# EAGLE design o_clone_rev_b (EAGLE 9.2.2)
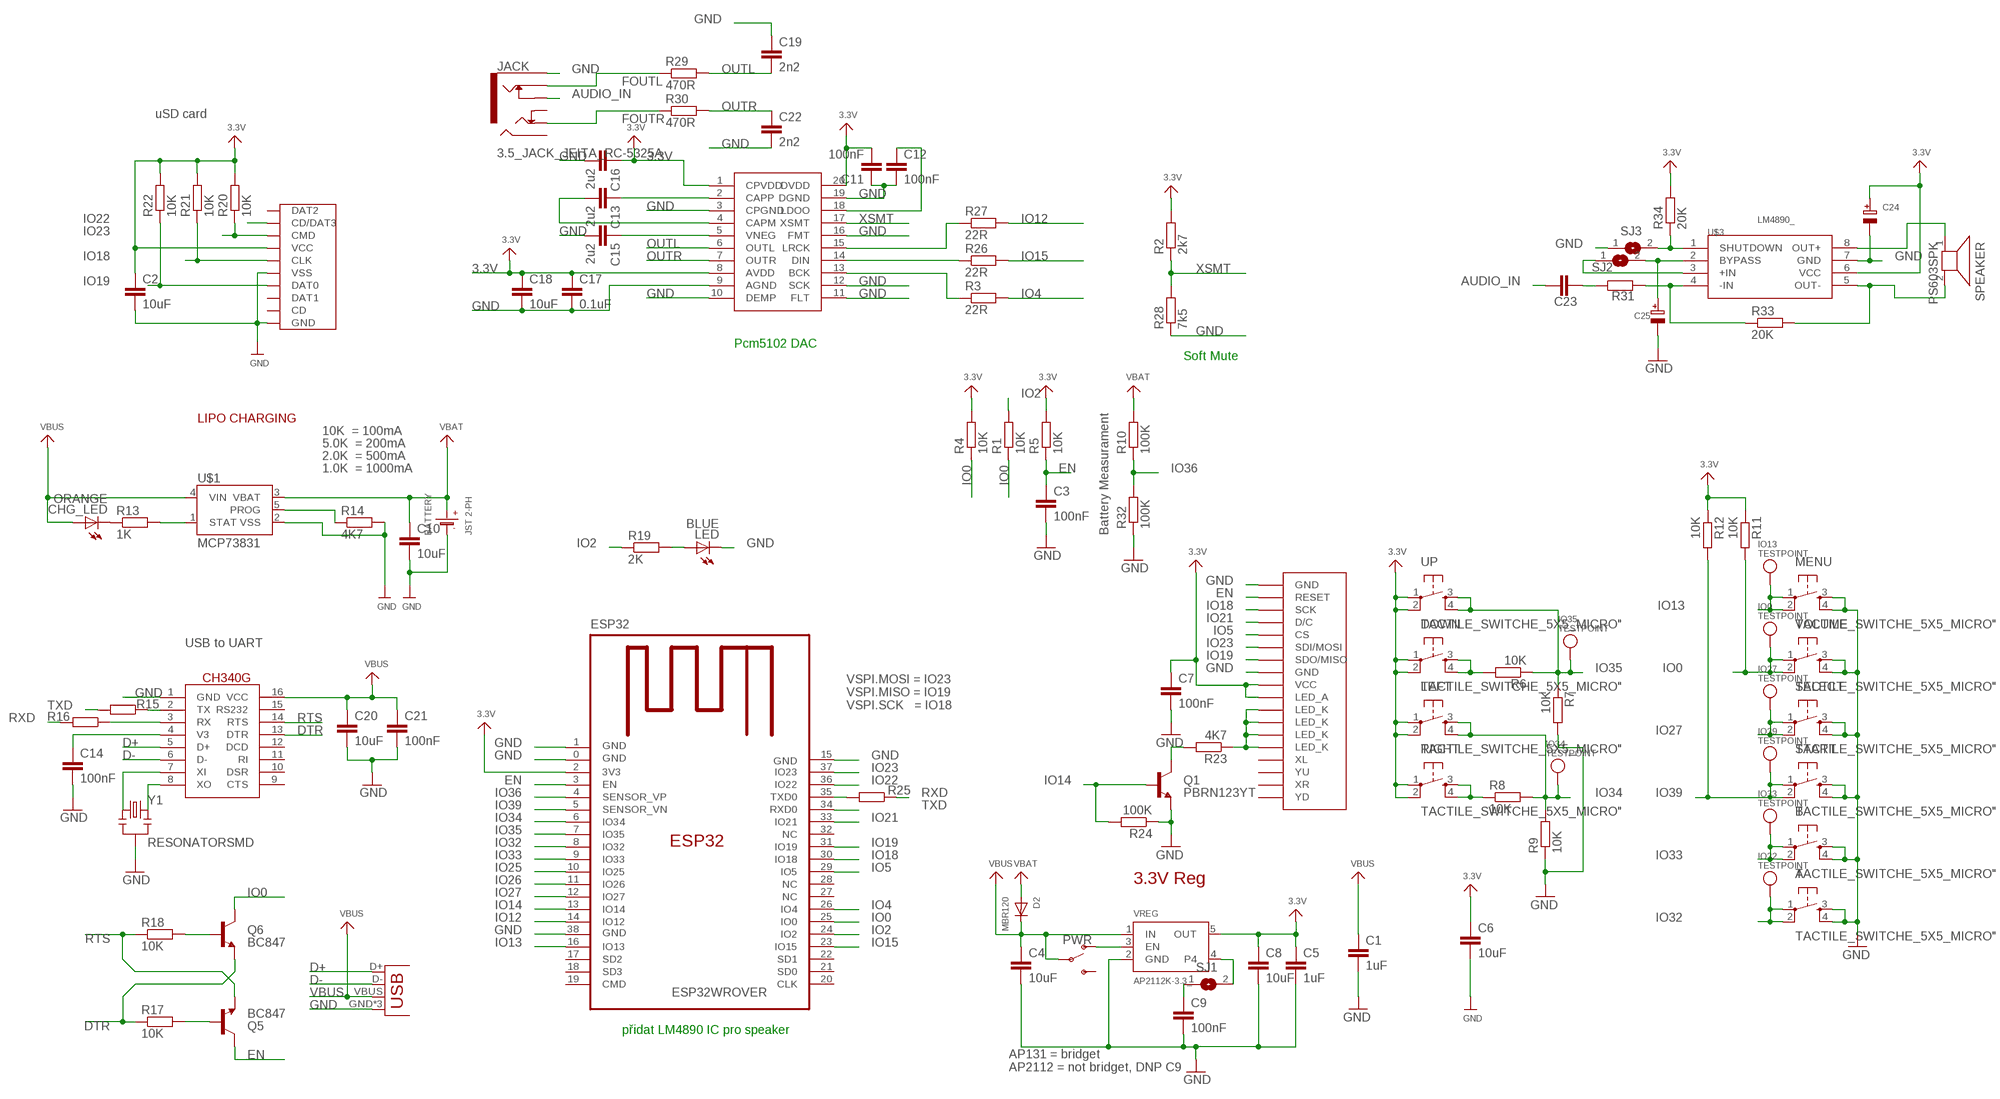
[diagram p0: schematic, sheet 1]

## Parts
A  TACTILE_SWITCHE_5X5_MICRO"  [TACTILE_SWITCH_5X5_MICRO]
B  TACTILE_SWITCHE_5X5_MICRO"  [TACTILE_SWITCH_5X5_MICRO]
BATTERY  JST 2-PH  JST_CONNECTOR  [JSTPH2]
C1  1uF  C-EUC0805  [C0805]
C2  10uF  C-EUC0805  [C0805]
C3  100nF  C-EUC0805  [C0805]
C4  10uF  C-EUC0805  [C0805]
C5  1uF  C-EUC0805  [C0805]
C6  10uF  C-EUC0805  [C0805]
C7  100nF  C-EUC0805  [C0805]
C8  10uF  C-EUC0805  [C0805]
C9  100nF  C-EUC0805  [C0805]
C10  10uF  C-EUC0805  [C0805]
C11  100nF  C-EUC0805  [C0805]
C12  100nF  C-EUC0805  [C0805]
C13  2u2  C-EUC0805  [C0805]
C14  100nF  C-EUC0805  [C0805]
C15  2u2  C-EUC0805  [C0805]
C16  2u2  C-EUC0805  [C0805]
C17  0.1uF  C-EUC0805  [C0805]
C18  10uF  C-EUC0805  [C0805]
C19  2n2  C-EUC0805  [C0805]
C20  10uF  C-EUC0805  [C0805]
C21  100nF  C-EUC0805  [C0805]
C22  2n2  C-EUC0805  [C0805]
C23  0.39uF (Fa:2896582)  C-EUC0805  [C0805]
C24  1uF (Fa:2491436)  CAP_TANTALUM_  [EIA2012]
C25  1uF (Fa:2491436)  CAP_TANTALUM_  [EIA2012]
CHG_LED  ORANGE  LEDCHIPLED_0805  [CHIPLED_0805]
D2  MBR120  DIODESOD-123  [SOD-123]
DOWN  TACTILE_SWITCHE_5X5_MICRO"  [TACTILE_SWITCH_5X5_MICRO]
ESP32  ESP32WROVER  [ESP32WROVER]
IO0  TESTPOINT  [TESTPOINT]
IO13  TESTPOINT  [TESTPOINT]
IO27  TESTPOINT  [TESTPOINT]
IO32  TESTPOINT  [TESTPOINT]
IO33  TESTPOINT  [TESTPOINT]
IO34  TESTPOINT  [TESTPOINT]
IO35  TESTPOINT  [TESTPOINT]
IO39  TESTPOINT  [TESTPOINT]
JACK  3.5_JACK_JEITA_RC-5325A  [3.5_JACK_JEITA_RC-5325A]
LCD  ILI9341_3.2LCD_  [LI9341_3.2LCD]
LED  BLUE  LEDCHIPLED_0805  [CHIPLED_0805]
LEFT  TACTILE_SWITCHE_5X5_MICRO"  [TACTILE_SWITCH_5X5_MICRO]
MENU  TACTILE_SWITCHE_5X5_MICRO"  [TACTILE_SWITCH_5X5_MICRO]
PCM5102  PCM5102  [TSSOP20]
PWR  SWITCH-SPDT-SMD-RIGHT-ANGLE  [SWITCH_SPST_SMD_A]
Q1  PBRN123YT  TRANSISTOR_NPNSOT23-3  [SOT23-3]
Q5  BC847  TRANSISTOR_NPNSOT23-3  [SOT23-3]
Q6  BC847  TRANSISTOR_NPNSOT23-3  [SOT23-3]
R1  10K  R-EU_R0805  [R0805]
R2  2k7  R-EU_R0805  [R0805]
R3  22R  R-EU_R0805  [R0805]
R4  10K  R-EU_R0805  [R0805]
R5  10K  R-EU_R0805  [R0805]
R6  10K  R-EU_R0805  [R0805]
R7  10K  R-EU_R0805  [R0805]
R8  10K  R-EU_R0805  [R0805]
R9  10K  R-EU_R0805  [R0805]
R10  100K  R-EU_R0805  [R0805]
R11  10K  R-EU_R0805  [R0805]
R12  10K  R-EU_R0805  [R0805]
R13  1K  R-EU_R0805  [R0805]
R14  4K7  R-EU_R0805  [R0805]
R15  470R  R-EU_R0805  [R0805]
R16  470R  R-EU_R0805  [R0805]
R17  10K  R-EU_R0805  [R0805]
R18  10K  R-EU_R0805  [R0805]
R19  2K  R-EU_R0805  [R0805]
R20  10K  R-EU_R0805  [R0805]
R21  10K  R-EU_R0805  [R0805]
R22  10K  R-EU_R0805  [R0805]
R23  4K7  R-EU_R0805  [R0805]
R24  100K  R-EU_R0805  [R0805]
R25  470R  R-EU_R0805  [R0805]
R26  22R  R-EU_R0805  [R0805]
R27  22R  R-EU_R0805  [R0805]
R28  7k5  R-EU_R0805  [R0805]
R29  470R  R-EU_R0805  [R0805]
R30  470R  R-EU_R0805  [R0805]
R31  20K  R-EU_R0805  [R0805]
R32  100K  R-EU_R0805  [R0805]
R33  20K  R-EU_R0805  [R0805]
R34  20K  R-EU_R0805  [R0805]
RIGHT  TACTILE_SWITCHE_5X5_MICRO"  [TACTILE_SWITCH_5X5_MICRO]
SD_CARD  MICRO_SD_CARD"  [TFP09-2--12B]
SELECT  TACTILE_SWITCHE_5X5_MICRO"  [TACTILE_SWITCH_5X5_MICRO]
SJ1  SJ  [SJ]
SJ2  SJ  [SJ]
SJ3  SJ  [SJ]
SPEAKER  PS603SPK  [PS603]
START  TACTILE_SWITCHE_5X5_MICRO"  [TACTILE_SWITCH_5X5_MICRO]
U$1  MCP73831  [SOT95P290X120-5]
U$3  LM4890_  [SOIC127P600X175-8]
U$23  CH340G  [SO16]
UP  TACTILE_SWITCHE_5X5_MICRO"  [TACTILE_SWITCH_5X5_MICRO]
USB  USB_MICRO_ATTEND_  [USB_MICRO]
VOLUME  TACTILE_SWITCHE_5X5_MICRO"  [TACTILE_SWITCH_5X5_MICRO]
VREG  AP2112K-3.3_  [SOT95P290X120-5]
Y1  RESONATORSMD  [RESONATOR-SMD]

## Nets
3.3V: C2.1 C5.1 C6.1 C7.1 C8.1 C11.2 C16.1 C17.1 C18.1 C24.+ DOWN.1 DOWN.2 ESP32.2(3V3) LCD.P$9(VCC) LCD.P$10(LED_A) LEFT.1 LEFT.2 PCM5102.1(CPVDD) PCM5102.8(AVDD) PCM5102.20(DVDD) R2.2 R4.2 R5.2 R11.1 R12.1 R20.2 R21.2 R22.2 R34.2 RIGHT.1 RIGHT.2 SD_CARD.VCC U$3.6(VCC) UP.1 UP.2 VREG.5(OUT)
AUDIO_IN: C23.1 JACK.6
D+: U$23.5(D+) USB.D+
D-: U$23.6(D-) USB.D-
DTR: Q6.2(E) R17.1 U$23.13(DTR)
EN: C3.1 ESP32.3(EN) LCD.P$2(RESET) Q5.3(C) R5.1
FOUTL: JACK.5 R29.1
FOUTR: JACK.3 R30.1
GND: A.3 A.4 B.3 B.4 BATTERY.1(-) C1.2 C2.2 C3.2 C4.2 C5.2 C6.2 C7.2 C8.2 C9.2 C10.2 C11.1 C12.2 C14.2 C15.2 C16.2 C17.2 C18.2 C19.1 C20.2 C21.2 C22.2 C24.- C25.- ESP32.0(GND) ESP32.1(GND) ESP32.15(GND) ESP32.38(GND) JACK.1 LCD.P$1(GND) LCD.P$8(GND) LED.C MENU.3 MENU.4 PCM5102.3(CPGND) PCM5102.9(AGND) PCM5102.10(DEMP) PCM5102.11(FLT) PCM5102.12(SCK) PCM5102.16(FMT) PCM5102.19(DGND) Q1.2(E) R7.2 R9.1 R14.2 R24.1 R28.1 R32.1 SD_CARD.GND SD_CARD.GND@1(GND) SD_CARD.GND@2(GND) SD_CARD.GND@3(VSS) SD_CARD.VSS(GND) SELECT.3 SELECT.4 SJ3.1 START.3 START.4 U$1.2(VSS) U$3.7(GND) U$23.1(GND) USB.GND USB.GND@2(GND) USB.GND@3(GND) VOLUME.3 VOLUME.4 VREG.2(GND) Y1.2
IO0: ESP32.25(IO0) IO0.P$1 Q6.3(C) R1.1 R4.1 R11.2 VOLUME.1 VOLUME.2
IO2: ESP32.24(IO2) R1.2 R19.1
IO4: ESP32.26(IO4) R3.2
IO5: ESP32.29(IO5) LCD.P$5(CS)
IO12: ESP32.14(IO12) R27.2
IO13: ESP32.16(IO13) IO13.P$1 MENU.1 MENU.2
IO14: ESP32.13(IO14) Q1.1(B) R24.2
IO15: ESP32.23(IO15) R26.2
IO18: ESP32.30(IO18) LCD.P$3(SCK) R21.1 SD_CARD.CLK
IO19: ESP32.31(IO19) LCD.P$7(SDO/MISO) R22.1 SD_CARD.DAT0
IO21: ESP32.33(IO21) LCD.P$4(D/C)
IO22: ESP32.36(IO22) SD_CARD.CD/DAT3
IO23: ESP32.37(IO23) LCD.P$6(SDI/MOSI) R20.1 SD_CARD.CMD
IO25: ESP32.10(IO25)
IO26: ESP32.11(IO26)
IO27: ESP32.12(IO27) IO27.P$1 SELECT.1 SELECT.2
IO32: A.1 A.2 ESP32.8(IO32) IO32.P$1
IO33: B.1 B.2 ESP32.9(IO33) IO33.P$1
IO34: ESP32.6(IO34) IO34.P$1 LEFT.3 LEFT.4 R8.2 R9.2
IO35: ESP32.7(IO35) IO35.P$1 R6.1 R7.1 UP.3 UP.4
IO36: ESP32.4(SENSOR_VP) R10.1 R32.2
IO39: ESP32.5(SENSOR_VN) IO39.P$1 R12.2 START.1 START.2
N$1: ESP32.35(TXD0) R25.2
N$2: R8.1 RIGHT.3 RIGHT.4
N$3: PWR.1(O) VREG.3(EN)
N$4: DOWN.3 DOWN.4 R6.2
N$5: Q1.3(C) R23.2
N$6: LED.A R19.2
N$7: SJ1.2 VREG.4
N$8: U$23.8(XO) Y1.3
N$9: C9.1 SJ1.1
N$10: PCM5102.13(BCK) R3.1
N$11: PCM5102.14(DIN) R26.1
N$12: PCM5102.15(LRCK) R27.1
N$13: C13.1 PCM5102.2(CAPP)
N$14: C13.2 PCM5102.4(CAPM)
N$15: C15.1 PCM5102.5(VNEG)
N$16: U$23.7(XI) Y1.1
N$17: C12.1 PCM5102.18(LDOO)
N$18: LCD.P$11(LED_K) LCD.P$12(LED_K) LCD.P$13(LED_K) LCD.P$14(LED_K) R23.1
N$19: CHG_LED.C R13.1
N$21: C25.+ SJ2.2 U$3.2(BYPASS)
N$22: C14.1 U$23.4(V3)
N$23: R15.1 U$23.2(TX)
N$24: R16.1 U$23.3(RX)
N$25: Q5.1(B) R17.2
N$26: Q6.1(B) R18.2
N$27: R13.2 U$1.1(STAT)
N$28: R14.1 U$1.5(PROG)
N$29: C23.2 R31.1
N$30: R31.2 R33.1 U$3.4(-IN)
N$31: R33.2 SPEAKER.2 U$3.5(OUT-)
N$32: SJ2.1 U$3.3(+IN)
N$33: SPEAKER.1 U$3.8(OUT+)
N$34: R34.1 SJ3.2 U$3.1(SHUTDOWN)
OUTL: C19.2 PCM5102.6(OUTL) R29.2
OUTR: C22.1 PCM5102.7(OUTR) R30.2
RTS: Q5.2(E) R18.1 U$23.14(RTS)
RXD: R16.2 R25.1
TXD: ESP32.34(RXD0) R15.2
VBAT: BATTERY.2(+) C10.1 D2.A R10.2 U$1.3(VBAT)
VBUS: C1.1 C4.1 C20.1 C21.1 CHG_LED.A D2.C PWR.2(P) U$1.4(VIN) U$23.16(VCC) USB.VBUS VREG.1(IN)
XSMT: PCM5102.17(XSMT) R2.1 R28.2
Unconnected: ESP32.17(SD2) ESP32.18(SD3) ESP32.19(CMD) ESP32.20(CLK) ESP32.21(SD0) ESP32.22(SD1) ESP32.27(NC) ESP32.28(NC) ESP32.32(NC) JACK.2 JACK.4 LCD.P$15(XL) LCD.P$16(XR) LCD.P$17(YD) LCD.P$18(YU) PWR.3(S) SD_CARD.CD SD_CARD.DAT1 SD_CARD.DAT2 U$23.9(CTS) U$23.10(DSR) U$23.11(RI) U$23.12(DCD) U$23.15(RS232)

## Notes on the sheet
- uSD card
- Pcm5102 DAC
- Soft Mute
- LIPO CHARGING
- 10K  = 100mA
- 5.0K  = 200mA
- 2.0K  = 500mA
- 1.0K  = 1000mA
- Battery Measurament
- USB to UART
- VSPI.MOSI = IO23
  VSPI.MISO = IO19
  VSPI.SCK   = IO18
- 3.3V Reg
- přidat LM4890 IC pro speaker
- AP131 = bridget
  AP2112 = not bridget, DNP C9

## Library data of the parts
A B DOWN LEFT MENU RIGHT SELECT START UP VOLUME = dronecz:TACTILE_SWITCHE_5X5_MICRO
BATTERY = dronecz:JST_CONNECTOR
C1-C23 = rcl:C-EU: CAPACITOR, European symbol; SPICEPREFIX: C
C24 = dronecz:CAP_TANTALUM: Tantalum Capacitors Wave footprints have larger pads and are meant to be used for hand soldering. Reflow footprints are optimised for solder paste and a reflow oven. EIA3216-18/A-[R/W] - Size A / 3216-18 / 1206 footprint 4.7µF 25V 10% Tantalum Capacitor 10µF 16V 10% Tantalum Capacitor [Digikey: 495-2236-2-ND] EIA3528-21/B-[R/W] - Size B / 3528-21 47µF 10V 10% Tantalum Capactior [Digikey: 495-2216-1-ND] EIA6032-28/C-[R/W] - Size C / 6032-28 10µF 35V 20% Tantalum Capacitor [Digikey: 495-2285-1-ND] 100µF 16V 10% Tantalum Capactior [Digikey: 399-5214-1-ND]; SPICEPREFIX: C
C25 = dronecz:CAP_TANTALUM: Tantalum Capacitors Wave footprints have larger pads and are meant to be used for hand soldering. Reflow footprints are optimised for solder paste and a reflow oven. EIA3216-18/A-[R/W] - Size A / 3216-18 / 1206 footprint 4.7µF 25V 10% Tantalum Capacitor 10µF 16V 10% Tantalum Capacitor [Digikey: 495-2236-2-ND] EIA3528-21/B-[R/W] - Size B / 3528-21 47µF 10V 10% Tantalum Capactior [Digikey: 495-2216-1-ND] EIA6032-28/C-[R/W] - Size C / 6032-28 10µF 35V 20% Tantalum Capacitor [Digikey: 495-2285-1-ND] 100µF 16V 10% Tantalum Capactior [Digikey: 399-5214-1-ND]
CHG_LED LED = led:LED: LED OSRAM: - CHIPLED LG R971, LG N971, LY N971, LG Q971, LY Q971, LO R971, LY R971 LH N974, LH R974 LS Q976, LO Q976, LY Q976 LO Q996 - Hyper CHIPLED LW Q18S LB Q993, LB Q99A, LB R99A - SideLED LS A670, LO A670, LY A670, LG A670, LP A670 LB A673, LV A673, LT A673, LW A673 LH A674 LY A675 LS A676, LA A676, LO A676, LY A676, LW A676 LS A679, LY A679, LG A679 - Hyper Micro SIDELED® LS Y876, LA Y876, LO Y876, LY Y876 LT Y87S - SmartLED LW L88C, LW L88S LB L89C, LB L89S, LG L890 LS L89K, LO L89K, LY L89K LS L896, LA L896, LO L896, LY L896 - TOPLED LS T670, LO T670, LY T670, LG T670, LP T670 LSG T670, LSP T670, LSY T670, LOP T670, LYG T670 LG T671, LOG T671, LSG T671 LB T673, LV T673, LT T673, LW T673 LH T674 LS T676, LA T676, LO T676, LY T676, LB T676, LH T676, LSB T676, LW T676 LB T67C, LV T67C, LT T67C, LS T67K, LO T67K, LY T67K, LW E67C LS E67B, LA E67B, LO E67B, LY E67B, LB E67C, LV E67C, LT E67C LW T67C LS T679, LY T679, LG T679 LS T770, LO T770, LY T770, LG T770, LP T770 LB T773, LV T773, LT T773, LW T773 LH T774 LS E675, LA E675, LY E675, LS T675 LS T776, LA T776, LO T776, LY T776, LB T776 LHGB T686 LT T68C, LB T68C - Hyper Mini TOPLED® LB M676 - Mini TOPLED Santana® LG M470 LS M47K, LO M47K, LY M47K Source: http://www.osram.convergy.de LUXEON: - LUMILED® LXK2-PW12-R00, LXK2-PW12-S00, LXK2-PW14-U00, LXK2-PW14-V00 LXK2-PM12-R00, LXK2-PM12-S00, LXK2-PM14-U00 LXK2-PE12-Q00, LXK2-PE12-R00, LXK2-PE12-S00, LXK2-PE14-T00, LXK2-PE14-U00 LXK2-PB12-K00, LXK2-PB12-L00, LXK2-PB12-M00, LXK2-PB14-N00, LXK2-PB14-P00, LXK2-PB14-Q00 LXK2-PR12-L00, LXK2-PR12-M00, LXK2-PR14-Q00, LXK2-PR14-R00 LXK2-PD12-Q00, LXK2-PD12-R00, LXK2-PD12-S00 LXK2-PH12-R00, LXK2-PH12-S00 LXK2-PL12-P00, LXK2-PL12-Q00, LXK2-PL12-R00 Source: www.luxeon.com KINGBRIGHT: KA-3528ASYC Source: www.kingbright.com
D2 = microbuilder:DIODE: Diode SMA Model Volts Amps Type Vf Vr Digikey # Notes SSA34-E3 40V 3A Schottky 480mV @ 3A 200uA @ 40V SSA34-E3/61TGITR-ND CDBA120-G 20V 1A Schottky 500mV @ 1A 500uA @ 20V 641-1014-6-ND REEL MBRA210 10V 2A Schottky 350mV @ 2A 700uA @ 10V MBRA210LT3 SOD-123 Model Volts Amps Type Vf Vr Order # Notes BAT54T1G 30V 200mA Schottky 800mV @ 200mA 2uA @ 25V BAT54T1GOSTR-ND B0530W 30V 500mA Schottky 430mV @ 500mA 130uA @ 30V B0530W-FDICT-ND REEL MBR120 1A 20V Schottky 340mV @ 1A MBR120VLSFT1GOSCT-ND SOD-323 Model Volts Amps Type Vf Vr Order # Notes PMEG2005EJ 20V 500mA Schottky 355mV @ 500mA 568-4110-1-ND ZLLS410 10V 570mA Schottky 380mV @ 570mA ZLLS410CT-ND 1N4148WS 75V 150mA Silicon/Simple 1V 1N4148WSFSCT-ND REEL SOD-523 Model Volts Amps Type Vf Vr Order # Notes BAT54XV2 30V 200mA Schottky 0.8V @ 100mA BAT54XV2CT-ND TB751S 30V 30mA Schottky RB751S-40TE61CT-ND SOT23-R/W (R = Solder Paste/Reflow Ovens, W = Hand-Soldering) Model Volts Amps Type Vf Vr Order # Notes BAT54FILM 40V 300mA Schottky 497-7162-1-ND
ESP32 = dronecz:ESP32WROVER
IO0 IO13 IO27 IO32-IO35 IO39 = dronecz:TESTPOINT
JACK = dronecz:3.5_JACK_JEITA_RC-5325A: https://www.lumberg.com/en/products/product/1503+21#downloads
LCD = dronecz:ILI9341_3.2LCD
PCM5102 = PCM5102:PCM5102
PWR = SparkFun-Switches:SWITCH-SPDT: Single Pole, Double Throw (SPDT) Switch Single-pole, double-throw (SPDT) switch. Variant Overview SMD-AYZ0202 Surface Mount DPDT Switch <https://www.sparkfun.com/products/597> (COM-00597) Used on e.g. LilyPad Arduino USB - ATmega32U4 Board <https://www.sparkfun.com/products/12049> PTH-11.6X4.0MM SPDT Mini Power Switch <https://www.sparkfun.com/products/102> (COM-00102) Used on e.g. SparkFun Simon Says - Through-Hole Soldering Kit <https://www.sparkfun.com/products/10547> (KIT-10547) PTH-11.6X4.0MM-KIT KIT version of SPDT Mini Power Switch - Simplifies soldering by removing tStop of switch pins - only one side can be soldered. PTH-11.6X4.0MM-LOCK LOCK version of SPDT Mini Power Switch - Offset pins hold switch in place for easier soldering. SMD-RIGHT-ANGLE Surface Mount Right Angle Switch <https://www.sparkfun.com/products/10860> (COM-10860) Used on e.g. SparkFun ESP8266 Thing <https://www.sparkfun.com/products/13231>; PROD_ID: SWCH-10651; SF_SKU: COM-10860
Q1 Q5 Q6 = SparkFun:TRANSISTOR_NPN: Transistor NPN BJT configuration in SOT23 package. MMBT2222 is the common NPN we use. Double check BCE configuration again layout.
R1-R34 = rcl:R-EU_: RESISTOR, European symbol; SPICEPREFIX: R
SD_CARD = dronecz:MICRO_SD_CARD
SJ1-SJ3 = jumper:SJ: SMD solder JUMPER
SPEAKER = adafruit:PS603: PS603 Small 8 ohm speaker, from Mouser. Can SMT solder to board http://www.ladyada.net/library/pcb/eaglelibrary.html
U$1 = dronecz:MCP73831
U$3 = dronecz:LM4890
U$23 = dronecz:CH340G
USB = dronecz:USB_MICRO_ATTEND: https://www.tme.eu/cz/Document/1cbb1fe1d020818ecbe0fffe16726397/207A-BBA0-R.pdf
VREG = dronecz:AP2112K-3.3
Y1 = SparkFun:RESONATOR: Resonator Small SMD resonator. This is the itty bitty 10/20MHz resonators with built in caps. CSTCE10M0G55 and CSTCE20M0V53. Footprint has been reviewed closely but hasn't been tested yet.

## Board
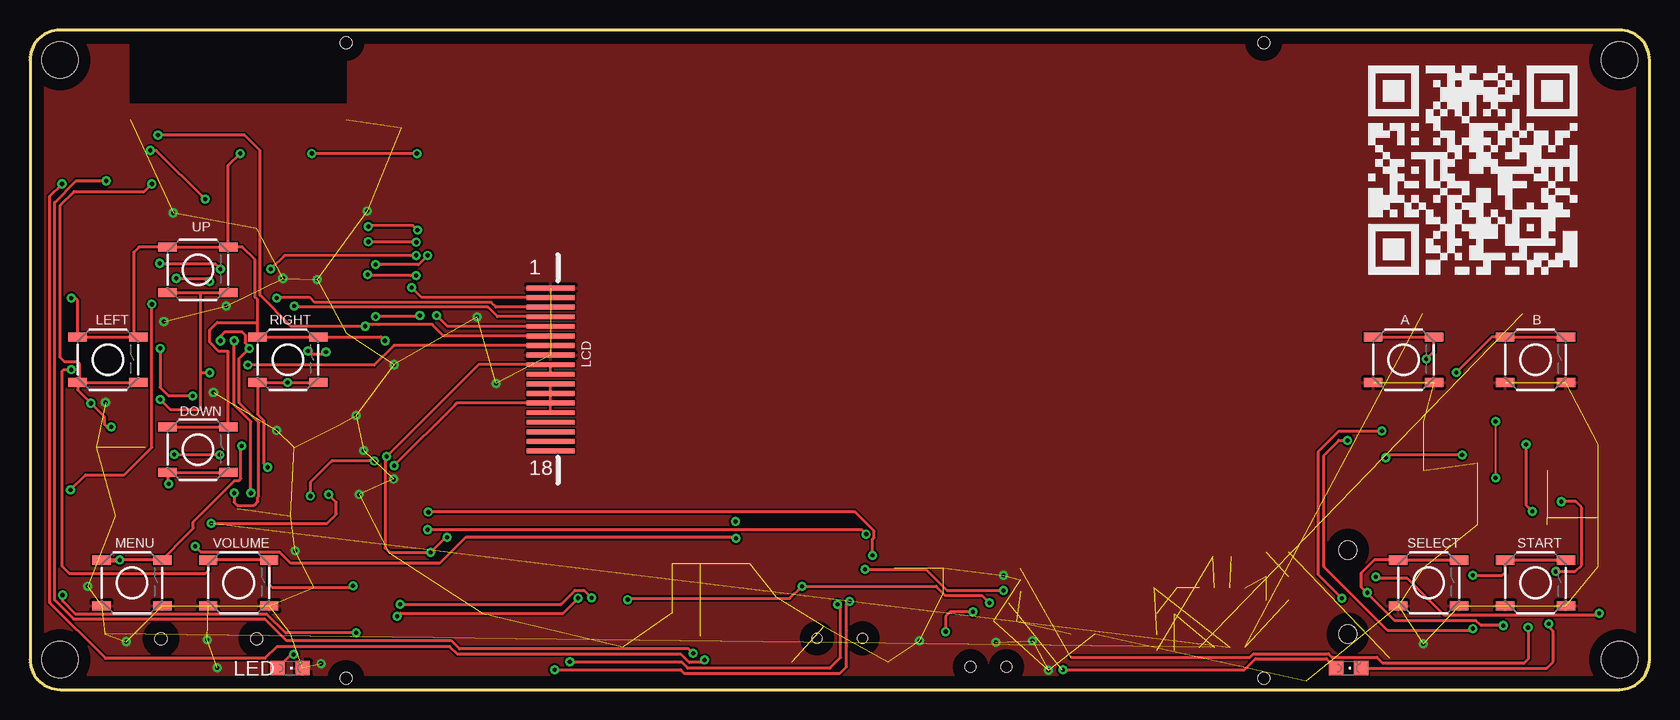
[diagram p1: board, top side]
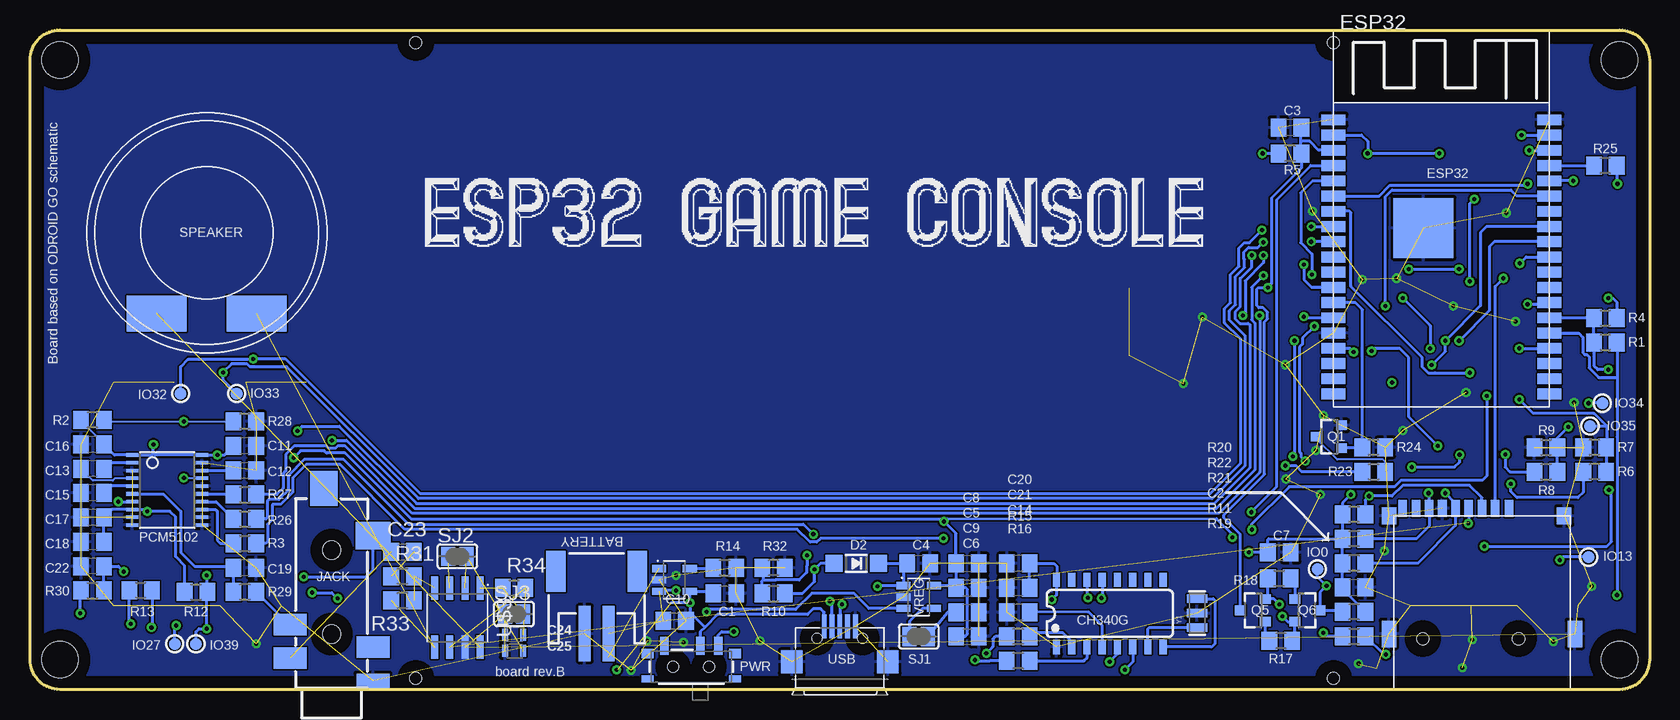
[diagram p2: board, bottom side, seen from below]

Size 135 x 55 mm. Coordinates in mm from the lower left corner, seen from the top.
Outline: 0,2.5 arc90 2.5,0 132.5,0 arc90 135,2.5 135,52.5 arc90 132.5,55 2.5,55 arc90 0,52.5 0,2.5
Copper layers (1*16): Top 0.035mm / dielectric 1.5mm / Bottom 0.035mm
Design rules "default": minimum track width 6mil, minimum drill 0.35mm, track to track 6mil, track to pad 6mil, pad to pad 6mil, via to via 6mil, smd to smd 6mil, copper to edge 40mil, drill to drill 6mil, minimum pad ring 10mil, minimum via ring 8mil, stop-mask expansion 4mil, vias tented up to drill 0mil, thermal gap 10mil
Holes 3 mm at 132.5,52.5 132.5,2.5 2.5,52.5 2.5,2.5

### Footprints (pad centres in the part's own frame; a part is rotated, then mirrored left to right if it is on the bottom)
TACTILE_SWITCH_5X5_MICRO = smd 1.524 x 0.762: 1 -2.54,1.905; 2 2.54,1.905; 3 -2.54,-1.905; 4 2.54,-1.905
JSTPH2 = smd 1 x 4.6: 1 -1,-3.7; 2 1,-3.7 | smd 1.6 x 3.4: NC1 -3.4,1.5; NC2 3.4,1.5
C0805 = smd 1.3 x 1.5: 1 -0.95,0; 2 0.95,0
EIA2012 = smd 0.5 x 1: + 0.75,0; - -0.75,0
CHIPLED_0805 = smd 1.2 x 1.2: A 0,-1.05; C 0,1.05
SOD-123 = smd 1.4 x 1.4: A 1.85,0; C -1.85,0
ESP32WROVER = smd 5 x 5: 0 -1.5,-0.75 | smd 2 x 0.9: 1 -9,8.26; 2 -9,6.99; 3 -9,5.72; 4 -9,4.45; 5 -9,3.18; 6 -9,1.91; 7 -9,0.64; 8 -9,-0.63; 9 -9,-1.9; 10 -9,-3.17; 11 -9,-4.44; 12 -9,-5.71; 13 -9,-6.98; 14 -9,-8.25; 15 -9,-9.52; 16 -9,-10.79; 17 -9,-12.06; 18 -9,-13.33; 19 -9,-14.6; 20 9,-14.6; 21 9,-13.33; 22 9,-12.06; 23 9,-10.79; 24 9,-9.52; 25 9,-8.25; 26 9,-6.98; 27 9,-5.71; 28 9,-4.44; 29 9,-3.17; 30 9,-1.9; 31 9,-0.63; 32 9,0.64; 33 9,1.91; 34 9,3.18; 35 9,4.45; 36 9,5.72; 37 9,6.99; 38 9,8.26
TESTPOINT = smd 1 x 1: P$1 0,0
3.5_JACK_JEITA_RC-5325A = smd 1.2 x 2.75: 1 0.6,-3.45 | smd 1.8 x 2.75: 2 3.4,-3.45; 5 5.3,3.45; 6 2.5,3.45 | smd 2.3 x 2.9: 3 12.7,-3.45 | smd 2.9 x 2.3: 4 16.65,0.65 | hole 1.5: 4.5,0; 11.5,0
LI9341_3.2LCD = smd 4 x 0.4: P$1 -24.089,6.127; P$2 -24.089,5.327; P$3 -24.089,4.527; P$4 -24.089,3.727; P$5 -24.089,2.927; P$6 -24.089,2.127; P$7 -24.089,1.327; P$8 -24.089,0.527; P$9 -24.089,-0.273; P$10 -24.089,-1.073; P$11 -24.089,-1.873; P$12 -24.089,-2.673; P$13 -24.089,-3.473; P$14 -24.089,-4.273; P$15 -24.089,-5.073; P$16 -24.089,-5.873; P$17 -24.089,-6.673; P$18 -24.089,-7.473 | hole 1: -41.156,-26.424; 35.344,-26.424; -41.156,26.576; 35.344,26.576
TSSOP20 = smd 0.305 x 0.991: 1 -2.925,-2.918; 2 -2.275,-2.918; 3 -1.625,-2.918; 4 -0.975,-2.918; 5 -0.325,-2.918; 6 0.325,-2.918; 7 0.975,-2.918; 8 1.625,-2.918; 9 2.275,-2.918; 10 2.925,-2.918; 11 2.925,2.918; 12 2.275,2.918; 13 1.625,2.918; 14 0.975,2.918; 15 0.325,2.918; 16 -0.325,2.918; 17 -0.975,2.918; 18 -1.625,2.918; 19 -2.275,2.918; 20 -2.925,2.918
SWITCH_SPST_SMD_A = smd 0.7 x 1.5: 1 -2.25,-1.75; 2 -0.75,-1.75; 3 2.25,-1.75 | smd 1 x 0.6: GND -3.65,1; GND@3 3.65,1 | smd 1 x 0.8: GND@1 -3.65,-1.1; GND@4 3.65,-1.1 | hole 0.9: -1.5,0; 1.5,0
SOT23-3 = smd 0.8 x 0.9: 1 -0.95,-1; 2 0.95,-1; 3 0,1.1
R0805 = smd 1.3 x 1.5: 1 -0.95,0; 2 0.95,0
TFP09-2--12B = smd 0.711 x 1.422: CD -6.6,7.85; CD/DAT3 1.1,7.85; CLK -2.2,7.85; CMD 0,7.85; DAT0 -4.4,7.85; DAT1 -5.5,7.85; DAT2 2.25,7.85; VCC -1.1,7.85; VSS -3.3,7.85 | smd 1.2 x 2.2: GND -7.75,-2.6; GND@1 7.75,-2.6 | smd 1.2 x 1.4: GND@2 -7.75,7.25; GND@3 6.85,7.25 | hole 1: -4.93,-3; 3.05,-3
SJ = smd 1.168 x 1.6: 1 -0.762,0; 2 0.762,0
PS603 = smd 5 x 3: 1 -4.184,-6.738; 2 4.184,-6.738
SOT95P290X120-5 = smd 1.18 x 0.609: 1 -1.274,0.95; 2 -1.274,0; 3 -1.274,-0.95; 4 1.274,-0.95; 5 1.274,0.95
SOIC127P600X175-8 = smd 1.968 x 0.602: 1 -2.473,1.905; 2 -2.473,0.635; 3 -2.473,-0.635; 4 -2.473,-1.905; 5 2.473,-1.905; 6 2.473,-0.635; 7 2.473,0.635; 8 2.473,1.905
SO16 = smd 0.6 x 1.2: 1 -4.445,-2.8; 2 -3.175,-2.8; 3 -1.905,-2.8; 4 -0.635,-2.8; 5 0.635,-2.8; 6 1.905,-2.8; 7 3.175,-2.8; 8 4.445,-2.8; 9 4.445,2.8; 10 3.175,2.8; 11 1.905,2.8; 12 0.635,2.8; 13 -0.635,2.8; 14 -1.905,2.8; 15 -3.175,2.8; 16 -4.445,2.8
USB_MICRO = smd 0.4 x 2: D+ 0,3.1; D- -0.65,3.1; GND 1.3,3.1; ID 0.65,3.1; VBUS -1.3,3.1 | smd 1.8 x 1.9: GND@2 -4,0.15; GND@3 4,0.15 | hole 0.8: -1.9,2.1; 1.9,2.1
RESONATOR-SMD = smd 0.7 x 1.7: 1 -1.2,0; 2 0,0; 3 1.2,0

### Placement (x,y rotation side)
A  114.5,27.5 0 top
B  125.5,27.5 0 top
BATTERY  87.77,8.36 0 bottom
C1  77.09,8 0 bottom
C2  24.64,8.51 0 bottom
C3  29.97,46.86 180 bottom
C4  60.92,10.51 0 bottom
C5  56.86,8.48 0 bottom
C6  56.86,4.42 0 bottom
C7  30.86,11.43 0 bottom
C8  56.86,10.51 0 bottom
C9  56.86,6.45 0 bottom
C10  81.26,5.74 0 bottom
C11  117.09,20.32 180 bottom
C12  117.09,18.29 0 bottom
C13  129.79,18.41 180 bottom
C14  52.62,6.45 180 bottom
C15  129.79,16.38 180 bottom
C16  129.79,20.45 180 bottom
C17  129.79,14.35 180 bottom
C18  129.79,12.32 180 bottom
C19  117.09,10.16 180 bottom
C20  52.62,10.51 180 bottom
C21  52.62,8.48 180 bottom
C22  129.79,10.29 180 bottom
C23  103.95,11.47 0 bottom
C24  94.65,4.58 0 bottom
C25  94.65,3.23 0 bottom
CHG_LED  109.92,1.78 270 top
D2  66.13,10.51 180 bottom
DOWN  14,20 0 top
ESP32  17.34,39.24 0 bottom
IO0  27.69,10.03 0 bottom
IO13  5.08,11.05 0 bottom
IO27  122.94,3.81 0 bottom
IO32  122.44,24.69 0 bottom
IO33  117.77,24.68 0 bottom
IO34  3.94,23.88 0 bottom
IO35  4.95,21.97 0 bottom
IO39  121.16,3.81 0 bottom
JACK  109.86,0.13 90 bottom
LCD  67.5,27.36 0 top
LED  21.68,1.78 270 top
LEFT  6.5,27.5 0 top
MENU  8.5,8.89 0 top
PCM5102  123.57,16.64 270 bottom
PWR  79.88,1.91 180 bottom
Q1  26.67,21.08 90 bottom
Q5  33.02,6.6 90 bottom
Q6  28.57,6.6 270 bottom
R1  3.68,28.96 0 bottom
R2  129.79,22.48 180 bottom
R3  117.09,12.19 0 bottom
R4  3.68,30.99 0 bottom
R5  29.97,44.7 180 bottom
R6  4.57,18.16 180 bottom
R7  4.57,20.19 180 bottom
R8  8.64,18.16 0 bottom
R9  8.64,20.19 0 bottom
R10  73.03,8 0 bottom
R11  24.64,6.48 180 bottom
R12  121.16,8.13 0 bottom
R13  125.77,8.28 0 bottom
R14  77.09,10.16 0 bottom
R15  52.62,4.42 180 bottom
R16  52.62,2.39 180 bottom
R17  30.73,4.06 180 bottom
R18  30.86,9.27 0 bottom
R19  24.64,4.45 0 bottom
R20  24.64,14.61 180 bottom
R21  24.64,10.54 180 bottom
R22  24.64,12.57 180 bottom
R23  22.99,18.16 0 bottom
R24  22.99,20.19 180 bottom
R25  3.68,43.69 180 bottom
R26  117.09,14.22 0 bottom
R27  117.09,16.26 0 bottom
R28  117.09,22.35 180 bottom
R29  117.09,8.13 180 bottom
R30  129.79,8.26 0 bottom
R31  103.95,9.45 0 bottom
R32  73.03,10.16 180 bottom
R33  103.95,7.42 180 bottom
R34  94.65,8.47 0 bottom
RIGHT  21.5,27.5 0 top
SD_CARD  13.97,7.24 0 bottom
SELECT  116.59,8.89 0 top
SJ1  60.92,4.42 180 bottom
SJ2  99.38,11.1 0 bottom
SJ3  94.65,6.3 0 bottom
SPEAKER  120.27,38.1 0 bottom
START  125.5,8.89 0 top
U$1  81.28,9.14 0 bottom
U$3  99.38,6 270 bottom
U$23  44.98,6.35 0 bottom
UP  14,35 0 top
USB  67.5,2.16 0 bottom
VOLUME  17.4,8.89 0 top
VREG  60.92,7.72 0 bottom
Y1  37.73,6.38 90 bottom

### Tracks (layer width: path | path; a pad name or v marks a point on that pad's centre or on a via)
3.3V  (via drill 0.35)  (3 unrouted)
  Top 0.254: 8.76,29.41 LEFT.1 3.96,32.49 3.81,32.64 v3.43,32.64 | 8.76,29.41 LEFT.2 | DOWN.1 DOWN.2 16.54,28.16 16.5,28.2 15.75,28.2 14.99,28.96 14.99,29.97 15.62,30.61 18.96,30.61 | UP.2 UP.1 9.09,36.91 8.64,36.45 8.64,29.53 8.76,29.41 | v125.22,14.86 124.71,15.37 v124.71,20.45 | v24.89,16.26 25.53,15.62 25.53,14.61 24.77,13.84 v15.11,13.84 | v32.26,44.7 v23.5,44.7 | v119.38,19.56 113.26,19.56 v113.03,19.33 | UP.2 16.54,43.72 v17.53,44.7 | 18.96,30.61 RIGHT.1 RIGHT.2 29.27,29.41 v29.59,29.08 | 18.96,30.61 18.96,32.53 18.77,32.73 18.77,35.84 17.7,36.91 UP.2 | v34.78,12.68 34.65,12.68 v33.4,11.43 29.97,11.43 29.59,11.81 29.59,19.3 v29.72,19.43 37.38,27.09 LCD.P$9 LCD.P$10
  Bottom 0.152: R2.2 130.74,22.41 128.78,20.45
  Bottom 0.254: R22.2 R21.2 C2.1 25.59,8.38 R11.1 | 57.81,8.7 C8.1 57.81,13.01 v58.81,14.01 | 57.81,8.7 C5.1 56.98,8.48 56.86,8.36 56.86,4.61 57.04,4.42 C6.1 | 128.78,20.45 C16.1 127.96,19.56 PCM5102.1 124.84,19.56 124.71,19.69 | C18.1 C17.1 128.18,15.01 PCM5102.8 125.38,15.01 v125.22,14.86 123.35,14.86 122.87,14.38 122.87,11.09 122.11,10.33 R12.1 | C11.2 118.8,19.56 v119.38,19.56 PCM5102.20 124.58,19.56 124.71,19.69 | R22.2 R20.2 25.59,15.56 v24.89,16.26 | SD_CARD.VCC 15.07,13.89 v15.11,13.84 | v33.4,11.43 C7.1 31.81,12.51 31.75,12.57 R22.2 | R5.2 v32.26,44.7 | ESP32.2 24.01,46.23 23.5,45.72 v23.5,44.7 v17.53,44.7 | 124.71,19.69 v124.71,20.45 | v3.43,32.64 3.05,32.64 2.73,32.32 R4.2 | v29.59,29.08 29.59,19.56 v29.72,19.43 | v58.81,14.01 59.01,14.21 103.21,14.21 108.71,19.71 110.27,19.71 110.47,19.91 112.44,19.91 v113.03,19.33 | v58.81,14.01 58.55,14.26 36.09,14.25 34.78,12.93 v34.78,12.68 | VREG.5 57.84,8.67 57.81,8.7
AUDIO_IN  (1 unrouted)
D+  (via drill 0.35)
  Top 0.254: v67.31,7.11 67.56,6.86 67.56,2.67 66.71,1.81 54.8,1.81 54.3,2.31 v45,2.31
  Bottom 0.254: U$23.5 44.35,2.96 v45,2.31 | v67.31,7.11 67.5,6.92 67.5,6.91 USB.D+
D-  (via drill 0.35)
  Top 0.254: v68.33,7.37 68.07,7.11 68.07,4.91 68.06,4.9 68.06,3.62 68.07,3.61 68.07,1.91 67.52,1.35 54.53,1.35 54.23,1.65 v43.73,1.65
  Bottom 0.254: U$23.6 43.08,2.3 v43.73,1.65 | USB.D- 68.2,5.27 68.2,7.24 v68.33,7.37
DTR  (via drill 0.35)
  Top 0.254: v30.61,6.1 30.89,6.38 44.45,6.38 v45.7,7.62 45.67,7.64
  Bottom 0.254: R17.1 29.57,4.27 Q6.2 30.16,5.65 v30.61,6.1 | U$23.13 45.62,7.7 v45.7,7.62
EN  (via drill 0.35)
  Top 0.254: LCD.P$2 32.66,32.69 v31.82,33.53
  Bottom 0.254: 29.08,45.72 29.08,46.8 C3.1 | 29.08,45.72 29.08,44.77 R5.1 29.02,43.48 31.51,41 31.51,33.84 v31.82,33.53 32.62,33.52 32.75,33.39 32.75,32.02 32.57,31.85 32.23,31.85 31.84,31.46 31.84,30.92 32.09,30.66 32.09,17.94 35.47,14.56 35.47,14.3 34.12,12.95 Q5.3 34.06,6.67 | ESP32.3 27.55,44.96 27.56,44.96 28.32,45.72 29.08,45.72
FOUTL
  Bottom 0.254: JACK.5 113.44,5.43 R29.1
FOUTR  (via drill 0.35)
  Top 0.254: v112.19,9.4 112.31,9.27 114.81,9.27 117.86,6.22 130.68,6.22 v130.81,6.35
  Bottom 0.254: v130.81,6.35 130.81,8.19 R30.1 | v112.19,9.4 107,9.4 106.4,10 JACK.3
GND  (via drill 0.35)  (99 unrouted)
  other vias: 24.26,2.16 4.82,8.62 27.18,22.86 22.1,11.56 20.57,21.59 23.94,34.19 21.08,34.29 27.43,16.26 30.3,17.55 30.34,27.08 27.81,19.94 11.94,39.75 28.11,39.91 81.14,9.52 80.52,3.94 74.14,4.06 83.57,4.06 84.89,1.6 116.14,3.82 15.59,1.82 14.77,4.15 8.02,4 38.84,25.52 37.27,31.07 16.34,31.97 11.17,30.7 15.29,24.77 6.29,23.95
  pour Top: 0,55.88 0,-0.13 136.14,-0.13 136.14,55.88
  pour Bottom: 0,55.88 0,-0.25 135.13,-0.25 135.13,55.88
IO0  (via drill 0.35)
  Top 0.254: v26.92,8.64 26.8,8.51 20.19,8.51 19.94,8.76 VOLUME.2 VOLUME.1 14.86,9.91 14.61,9.65 3.3,9.65 2.67,10.29 2.67,26.54 2.79,26.67 v3.43,26.67
  Bottom 0.254: R11.2 25.71,6.6 Q6.3 27.48,8.09 v26.92,8.64 27.69,9.4 IO0.P$1 | v3.43,26.67 4.32,26.67 4.63,26.98 R1.1 R4.1 ESP32.25
IO2  (via drill 0.35)
  Top 0.254: v27.18,4.72 21.32,4.72 19.75,6.29 3.81,6.29 2.71,7.38 v2.71,7.87
  Bottom 0.254: R19.1 26.9,4.45 v27.18,4.72 | 2.69,28.92 R1.2 2.7,28.92 2.7,25.95 | ESP32.24 5.91,29.72 5.56,29.37 5.56,28.09 5.4,27.93 5.22,27.93 5.04,27.75 5.04,26.82 4.24,26.01 2.76,26.01 2.7,25.95 | 2.7,25.95 2.7,21.07 2.69,21.06 2.69,7.9 v2.71,7.87
IO4  (via drill 0.35)
  Top 0.254: v13.77,11.94 14.25,11.46 20.82,11.46 21.73,10.54 34.16,10.54 36.32,12.7 58.76,12.7 v58.86,12.6 | v3.37,16.64 4.64,17.91 7.87,17.91 10.16,20.19 v10.16,32.13
  Bottom 0.254: v13.77,11.94 3.56,11.94 3.17,12.32 3.17,16.44 v3.37,16.64 | v10.16,32.13 8.47,32.13 ESP32.26 | 116.14,12.43 R3.2 115.32,12.19 115.19,12.32 115.19,13.78 114.81,14.16 114.81,15.37 114.73,15.44 114.09,15.44 113.09,16.45 113.09,17.66 111.99,18.76 109.16,18.76 103.77,13.37 71.05,13.37 69.97,12.3 69.43,12.3 69.12,12.6 v58.86,12.6
IO5  (via drill 0.35)
  Top 0.254: v15.88,35.05 15.46,35.47 10.89,35.47 v10.81,35.54 | v32.18,36.2 21.21,36.2 v20.07,35.05 | LCD.P$5 34.81,30.29 v33.9,31.2
  Bottom 0.254: v20.07,35.05 v15.88,35.05 | ESP32.29 10.29,36.07 v10.81,35.54 | v33.9,31.2 33.7,31.4 33.7,34.08 32.18,35.6 v32.18,36.2
IO12  (via drill 0.35)
  Top 0.254: v32.5,31.19 32.4,31.09 v28.8,31.09
  Bottom 0.254: ESP32.14 28.71,30.99 v28.8,31.09 | v32.5,31.19 32.5,18.11 35.91,14.7 103.12,14.7 108.75,20.32 109.35,20.32 109.55,20.12 110.1,20.12 110.3,20.32 112.97,20.32 113.69,19.6 113.69,18.21 113.9,18 113.9,16.78 114.43,16.26 R27.2
IO13  (via drill 0.35)
  Top 0.254: v17.65,20.32 17.58,20.25 17.58,17.6 17.42,17.43 17.06,17.43 13.61,13.99 13.61,13.44 13.11,12.94 MENU.2 MENU.1 6.06,10.7 7.38,10.7 v7.48,10.79 | v23.17,28.22 23.39,28 24.52,28 v24.67,28.15
  Bottom 0.254: v17.65,20.32 20.07,22.73 20.07,27.69 20.83,28.45 22.94,28.45 v23.17,28.22 | IO13.P$1 7.22,11.05 v7.48,10.79 | ESP32.16 24.97,28.45 v24.67,28.15
IO14
  Bottom 0.254: Q1.1 25.61,20.19 R24.2 23.94,31.68 24.51,32.26 ESP32.13
IO15  (via drill 0.35)
  Top 0.254: v10.85,28.45 10.85,25.19 11.55,24.48 v13.57,24.48 | v33.15,13.34 69.32,13.34 v69.7,12.95
  Bottom 0.254: v13.57,24.48 13.57,17.8 13.92,17.45 20.72,17.45 21.25,16.91 30.04,16.91 33.15,13.81 v33.15,13.34 | v69.7,12.95 70.53,13.78 103.45,13.78 108.85,19.18 112.15,19.18 113.49,17.83 113.49,16.61 114.26,15.85 115.09,15.85 115.22,15.72 115.22,14.32 115.32,14.22 R26.2 116.14,14.38 | v10.85,28.45 ESP32.23
IO18  (via drill 0.35)
  Top 0.254: v17.02,16.38 17.02,15.62 17.27,15.37 18.67,15.37 18.98,15.68 18.98,16.02 19.07,16.11 19.07,22.27 17.43,23.91 17.43,27.59 v18.29,28.45 18.29,28.54 17.92,28.91 17.92,29.58 17.65,29.84 16.26,29.84 15.88,29.46 v15.88,29.08 | v20.57,32.64 20.63,32.69 23.33,32.69 23.74,32.28 38.44,32.28 38.83,31.89 LCD.P$3
  Bottom 0.254: R21.1 19.3,10.54 16.17,13.68 SD_CARD.CLK 16.17,15.54 v17.02,16.38 | v20.57,32.64 18.29,30.35 v18.29,28.45 | ESP32.30 12.95,37.34 13.34,36.96 13.34,31.62 v15.88,29.08
IO19  (via drill 0.35)
  Top 0.254: v18.41,16.38 18.41,22.35 17.02,23.75 v17.02,29.08 | v18.16,27.05 28.7,27.05 30.34,28.69 LCD.P$7
  Bottom 0.254: R22.1 19.43,12.57 18.37,13.63 SD_CARD.DAT0 18.37,16.34 v18.41,16.38 | v18.16,27.05 17.02,28.19 v17.02,29.08 14.1,32 14.1,38.1 13.58,38.61 ESP32.31
IO21  (via drill 0.35)
  Top 0.254: v22.02,31.98 22.09,32.04 22.25,31.88 38.17,31.88 38.96,31.09 LCD.P$4
  Bottom 0.254: v22.02,31.98 22.02,41.1 21.46,41.66 11.56,41.66 11.05,41.15 ESP32.33
IO22  (via drill 0.35)
  Top 0.254: v12.19,34.29 14.73,34.29 v14.99,34.04 | v14.61,40.89 10.54,44.96 v10.03,44.96
  Bottom 0.254: SD_CARD.CD/DAT3 12.87,33.61 v12.19,34.29 | v14.99,34.04 14.99,40.51 v14.61,40.89 | v10.03,44.96 ESP32.36
IO23  (via drill 0.35)
  Top 0.254: v10.67,46.23 17.91,46.23 19.18,44.96 19.18,32.89 21.78,30.29 v27.94,30.29 28.1,30.45 28.51,30.45 28.53,30.43 29.07,30.43 29.09,30.45 33.52,30.45 34.48,29.49 LCD.P$6 | v28.7,19.05 25.15,19.05 23.37,17.27 v23.37,16.13
  Bottom 0.254: SD_CARD.CMD 13.97,16 15.01,17.04 20.55,17.04 21.46,16.13 v23.37,16.13 23.69,15.81 R20.1 | v10.67,46.23 ESP32.37 | v27.94,30.29 28.93,29.3 28.93,28.81 29.18,28.56 29.18,19.83 29.06,19.7 29.06,19.41 v28.7,19.05
IO27  (via drill 0.35)
  Top 0.254: SELECT.2 SELECT.1 112.05,10.79 110.95,9.7 110.95,8.55 111.42,8.08 v111.49,8.08 111.49,8.01 113.75,5.74 120.54,5.74 120.94,5.33 v122.81,5.33 | v109.36,7.6 107.39,9.57 107.39,19.84 109.1,21.55 v112.7,21.55 | v33.16,36.2 32.39,35.43 v28.8,35.43
  Bottom 0.254: ESP32.12 28.13,33.53 28.8,34.21 v28.8,35.43 | v109.36,7.6 109.85,8.08 v111.49,8.08 | IO27.P$1 122.94,5.21 v122.81,5.33 | v112.7,21.55 112.31,21.94 109.22,21.94 102.79,15.51 36.29,15.51 33.31,18.49 33.31,30.4 33.44,30.52 34.16,30.52 34.56,30.93 34.56,31.47 34.11,31.92 34.11,34.28 33.16,35.23 v33.16,36.2
IO32  (via drill 0.35)
  Top 0.254: v28.2,38.61 28.3,38.71 31.9,38.71 v32.3,38.31 | A.1 A.2 117.04,28.21 v116.39,27.56
  Bottom 0.254: ESP32.8 v28.2,38.61 | IO32.P$1 122.44,26.91 121.79,27.56 v116.39,27.56 113.69,27.56 102.45,16.33 36.63,16.33 34.12,18.84 34.12,29.27 35.42,30.57 35.42,31.76 34.92,32.26 34.92,34.61 34.22,35.31 34.22,36.82 33.77,37.26 33.34,37.26 v32.3,38.31
IO33  (via drill 0.35)
  Top 0.254: B.2 B.1 121.86,29.41 v118.89,26.43 | v32.2,37.3 28.24,37.3 v28.2,37.34
  Bottom 0.254: ESP32.9 v28.2,37.34 | v32.2,37.3 32.64,36.86 33.43,36.86 33.81,36.47 33.81,35.93 33.77,35.88 33.77,35.19 34.51,34.45 34.51,32.09 35.02,31.59 35.02,30.81 33.72,29.51 33.72,18.66 36.46,15.92 102.62,15.92 113.6,26.9 116.67,26.9 116.92,27.15 118.2,27.15 118.89,26.46 v118.89,26.43 118.89,25.8 IO33.P$1
IO34  (via drill 0.35)
  Top 0.254: LEFT.3 LEFT.4 | v6.76,21.89 6.43,21.89 6.22,22.1 6.22,22.73 v5.08,23.88 3.96,25 LEFT.3 | v10.16,42.16 9.53,41.53 3.68,41.53 2.54,40.39 2.54,27.67 2.85,27.36 3.91,27.36 4.09,27.19 4.09,25.72 LEFT.3
  Bottom 0.254: R8.2 R9.2 7.69,20.96 v6.76,21.89 | ESP32.6 22.54,41.15 21.63,42.06 10.26,42.06 v10.16,42.16 | IO34.P$1 v5.08,23.88
IO35  (via drill 0.35)
  Top 0.254: UP.3 14.22,33.09 | 14.22,33.09 UP.4 | 14.22,26.42 14.22,23.36 11.67,23.36 v10.85,24.19 | 14.22,26.42 14.22,33.09 | v14.99,26.42 14.22,26.42
  Bottom 0.254: R7.1 3.62,20.07 | 3.62,20.07 R6.1 | 3.56,21.84 3.56,21.97 4.65,23.06 9.72,23.06 v10.85,24.19 | 3.56,21.84 3.56,20.13 3.62,20.07 | v14.99,26.42 17.87,26.42 17.89,26.39 18.43,26.39 18.95,26.91 18.95,27.67 24.89,33.61 24.89,39.75 25.02,39.88 ESP32.7 | IO35.P$1 3.68,21.97 3.56,21.84
IO36  (via drill 0.35)
  Top 0.254: v70.23,11.18 70.23,12.55 70.36,12.68 70.36,13.23 68.78,14.8 v33.2,14.8
  Bottom 0.254: R10.1 73.97,9.08 73.91,9.14 | R32.2 73.91,10.1 73.91,9.14 | 73.91,9.14 72.85,9.14 72.84,9.13 70.88,9.13 70.25,9.76 70.25,10.3 70.23,10.33 v70.23,11.18 | v33.2,14.8 31.1,16.9 31.1,40.83 28.23,43.7 ESP32.4
IO39  (via drill 0.35)
  Top 0.254: START.2 START.1 122.96,9.76 122.72,9.53 v120.27,9.53 | v120.27,5.08 120.14,4.95 113.16,4.95 107.86,10.24 107.86,19.54 109.1,20.77 v109.83,20.77 | v32.2,34.52 28.21,34.52 v28.14,34.6
  Bottom 0.254: v120.27,9.53 120.27,8.19 | 120.27,8.19 R12.2 | 120.27,8.19 v120.27,5.08 120.9,5.08 121.16,4.83 IO39.P$1 | v109.83,20.77 108.62,20.77 102.96,15.11 36.11,15.11 32.9,18.31 32.9,30.56 33.16,30.82 33.16,33.56 v32.2,34.52 | v28.14,34.6 28.14,36.32 29.07,37.25 29.07,41.43 28.08,42.42 ESP32.5
N$1
  Bottom 0.254: ESP32.35 R25.2
N$2  (via drill 0.35)
  Top 0.254: RIGHT.4 v21.46,25.59 RIGHT.3 18.96,22.96 19.48,22.44 19.48,18.88 v19.81,18.54 | v15.83,19.58 12.03,19.58 v12.03,19.61
  Bottom 0.254: v19.81,18.54 16.27,18.54 15.83,18.98 v15.83,19.58 | R8.1 11.63,18.16 12.03,18.56 v12.03,19.61
N$3  (via drill 0.35)
  Top 0.254: v78.61,6.48 76.71,6.48 76.33,6.1 v76.33,4.83
  Bottom 0.254: PWR.1 77.63,4.54 77.34,4.83 v76.33,4.83 | VREG.3 65.06,6.77 66.32,8.02 69.83,8.02 71.17,6.67 78.42,6.67 v78.61,6.48
N$4  (via drill 0.35)
  Top 0.254: DOWN.4 DOWN.3 11.46,17.24 v11.56,17.14
  Bottom 0.254: R6.2 5.52,16.45 5.97,16 11.05,16 11.56,16.51 v11.56,17.14
N$5
  Bottom 0.152: R23.2 22.04,18.99 22.23,19.18 26.04,19.18 27.77,20.91 Q1.3
N$6  (via drill 0.35)
  Top 0.254: LED.A 21.78,2.92 v21.97,2.92
  Bottom 0.254: v21.97,2.92 22.16,2.92 R19.2
N$7
  Bottom 0.254: VREG.4 60.6,6.77 61.68,5.69 SJ1.2
N$8
  Bottom 0.254: Y1.3 36.38,7.58 36.23,7.42 36.23,3.83 36.52,3.52 36.55,3.55 U$23.8
N$9
  Bottom 0.254: SJ1.1 58.51,6.45 C9.1
N$10
  Bottom 0.254: PCM5102.13 119.53,15.01 119.38,14.86 119.38,12.45 119.13,12.19 R3.1
N$11
  Bottom 0.254: PCM5102.14 119.48,15.66 R26.1
N$12
  Bottom 0.254: PCM5102.15 118.1,16.31 R27.1
N$13
  Bottom 0.254: PCM5102.2 128.35,18.91 C13.1
N$14
  Bottom 0.152: PCM5102.4 127.92,17.61 128.1,17.44 129.76,17.44 C13.2
N$15
  Bottom 0.254: PCM5102.5 128.26,16.96 C15.1
N$16
  Bottom 0.254: U$23.7 41.81,5.07 41.7,5.17 Y1.1
N$17
  Bottom 0.254: PCM5102.18 118.07,18.26 C12.1
N$18  (via drill 0.35)
  Top 0.254: 35.58,23.89 35.43,23.75 | 35.43,23.75 v30.35,18.67 | LCD.P$14 LCD.P$13 | LCD.P$13 LCD.P$12 LCD.P$11 | LCD.P$13 35.58,23.89 | 35.58,23.89 35.43,23.75
  Bottom 0.254: R23.1 28.96,18.16 29.47,18.67 v30.35,18.67
N$19  (via drill 0.35)
  Top 0.254: CHG_LED.C 126.43,1.78 126.97,2.33 126.97,4.88 126.6,5.25 v126.6,5.47
  Bottom 0.254: 126.87,8.13 R13.1 126.72,5.59 v126.6,5.47
N$21  (2 unrouted)
N$22
  Bottom 0.254: U$23.4 45.62,5.32 46.78,6.48 C14.1
N$23
  Bottom 0.254: U$23.2 48.16,3.98 48.9,4.72 51,4.72 R15.1
N$24
  Bottom 0.254: U$23.3 46.88,3.46 46.88,3.08 46.88,2.65 47.14,2.39 R16.1
N$25
  Bottom 0.254: R17.2 32.02,4.4 Q5.1
N$26
  Bottom 0.254: R18.2 29.57,8.94 Q6.1
N$27  (via drill 0.35)  (1 unrouted)
  Top 0.254: v124.88,5.17 124.88,2.55 124.51,2.18 112.79,2.18 112.28,2.7 108.53,2.7 108.23,2.99 102,2.99 101.71,2.7 86.78,2.7
  Bottom 0.254: R13.2 124.82,5.23 v124.88,5.17
N$28
  Bottom 0.254: R14.1 78.11,10.09 U$1.5
N$29  (1 unrouted)
N$30  (2 unrouted)
N$31  (2 unrouted)
N$32  (1 unrouted)
N$33  (1 unrouted)
N$34  (2 unrouted)
OUTL
  Bottom 0.254: PCM5102.6 123.88,16.31 122.43,14.86 122.43,11.43 121.28,10.29 118.17,10.29 C19.2 R29.2
OUTR  (via drill 0.35)
  Top 0.254: v127.18,9.84 128.81,9.84 129.34,10.37 129.34,15.17 128.84,15.67 v127.64,15.67
  Bottom 0.254: C22.1 128.78,10.29 | 128.78,10.29 127.63,10.29 v127.18,9.84 | v127.64,15.67 127.63,15.66 PCM5102.7 | R30.2 128.84,10.22 128.78,10.29
RTS  (via drill 0.35)
  Top 0.254: v46.81,7.64 46.17,8.28 45.42,8.28 44.26,7.11 v30.86,7.11
  Bottom 0.254: R18.1 31.81,7.76 Q5.2 31.3,7.55 v30.86,7.11 | U$23.14 46.89,7.71 v46.81,7.64
RXD  (via drill 0.35)
  Top 0.254: v2.67,42.16 1.65,41.15 1.65,7.24 6.29,2.6 19.58,2.6 20.56,3.58 34.99,3.58 35.61,2.97 54.23,2.97 54.95,2.25 56.02,2.25 v56.23,2.47
  Bottom 0.254: v2.67,42.16 2.67,43.62 R25.1 | R16.2 54.98,2.39 55.02,2.36 56.12,2.36 v56.23,2.47
TXD  (via drill 0.35)
  Top 0.254: v6.35,42.42 3.85,42.42 2.06,40.62 2.06,7.47 3.64,5.88 19.58,5.88 21.4,4.06 35.14,4.06 35.81,3.39 54.91,3.39 v55.29,3.01
  Bottom 0.254: v6.35,42.42 ESP32.34 | R15.2 54.51,4.42 54.74,4.19 54.74,3.56 v55.29,3.01
VBAT  (via drill 0.35)  (2 unrouted)
  Top 0.254: v81.15,8.26 76.45,8.26 74.68,10.03 v69.6,10.03
  Bottom 0.254: D2.A 69.11,10.51 v69.6,10.03 69.6,9.02 70.61,8 R10.2 | 82.28,5.67 C10.1 | v81.15,8.26 82.49,8.26 U$1.3
VBUS  (via drill 0.35)  (1 unrouted)
  Top 0.254: v79.98,7.24 79.37,7.85 76.29,7.85 75.53,8.61 v64.35,8.61 63.33,7.59 49.93,7.59 v49.83,7.49 | v86.1,1.65 101.23,1.65 102.16,2.58 108.07,2.58 CHG_LED.A
  Bottom 0.254: 49.43,9.51 49.43,9.22 | 49.43,9.22 U$23.16 49.43,7.89 v49.83,7.49 | C21.1 C20.1 49.63,10.51 49.4,10.29 49.4,9.25 49.43,9.22 | USB.VBUS 68.8,6.44 69.09,6.73 69.72,6.73 70.19,6.27 77.68,6.27 78.74,5.21 | v64.35,8.61 64.29,8.67 VREG.1 62.19,10.19 62.16,10.23 | C4.1 62.16,10.23 | D2.C 62.44,10.51 62.16,10.23 | PWR.2 79.13,4.81 78.74,5.21 | v79.98,7.24 80,7.26 U$1.4 78.23,8.19 C1.1 | v79.98,7.24 79.98,6.45 78.74,5.21 | v79.98,7.24 81.56,7.24 | 86.03,1.65 v86.1,1.65
XSMT  (via drill 0.35)
  Top 0.152: v122.17,17.65 v122.17,22.35
  Bottom 0.152: PCM5102.17 122.13,17.61 v122.17,17.65 | v122.17,22.35 122.05,22.35 | 122.05,22.35 R28.2 | R2.1 128.72,22.35 122.05,22.35

### Text on the board
bPlace: Board based on ODROID GO schematic | CH340G | board rev.B
bNames: SPEAKER